# Altium schematic sheet Sheet1.SchDoc
size A4; CompanyName: Shanghai MCUStar Electronic Technology Co., Ltd.; Engineer: Conan; Address1: http://www.mcustar.com; PageSetup: Record=PageOptions|CenterHorizontal=True|CenterVertical=True|PrintScale=0.96|XCorrection=1.00|YCorrection=1.00|PrintKind=0|BorderSize=5000000|LeftOffset=0|BottomOffset=0|Orientation=2|PaperLength=1000|PaperWidth=1000|Scale=100|PaperSource=7|PrintQuality=-4|MediaType=1|DitherType=10|PaperKind=A4|PrintScaleMode=1
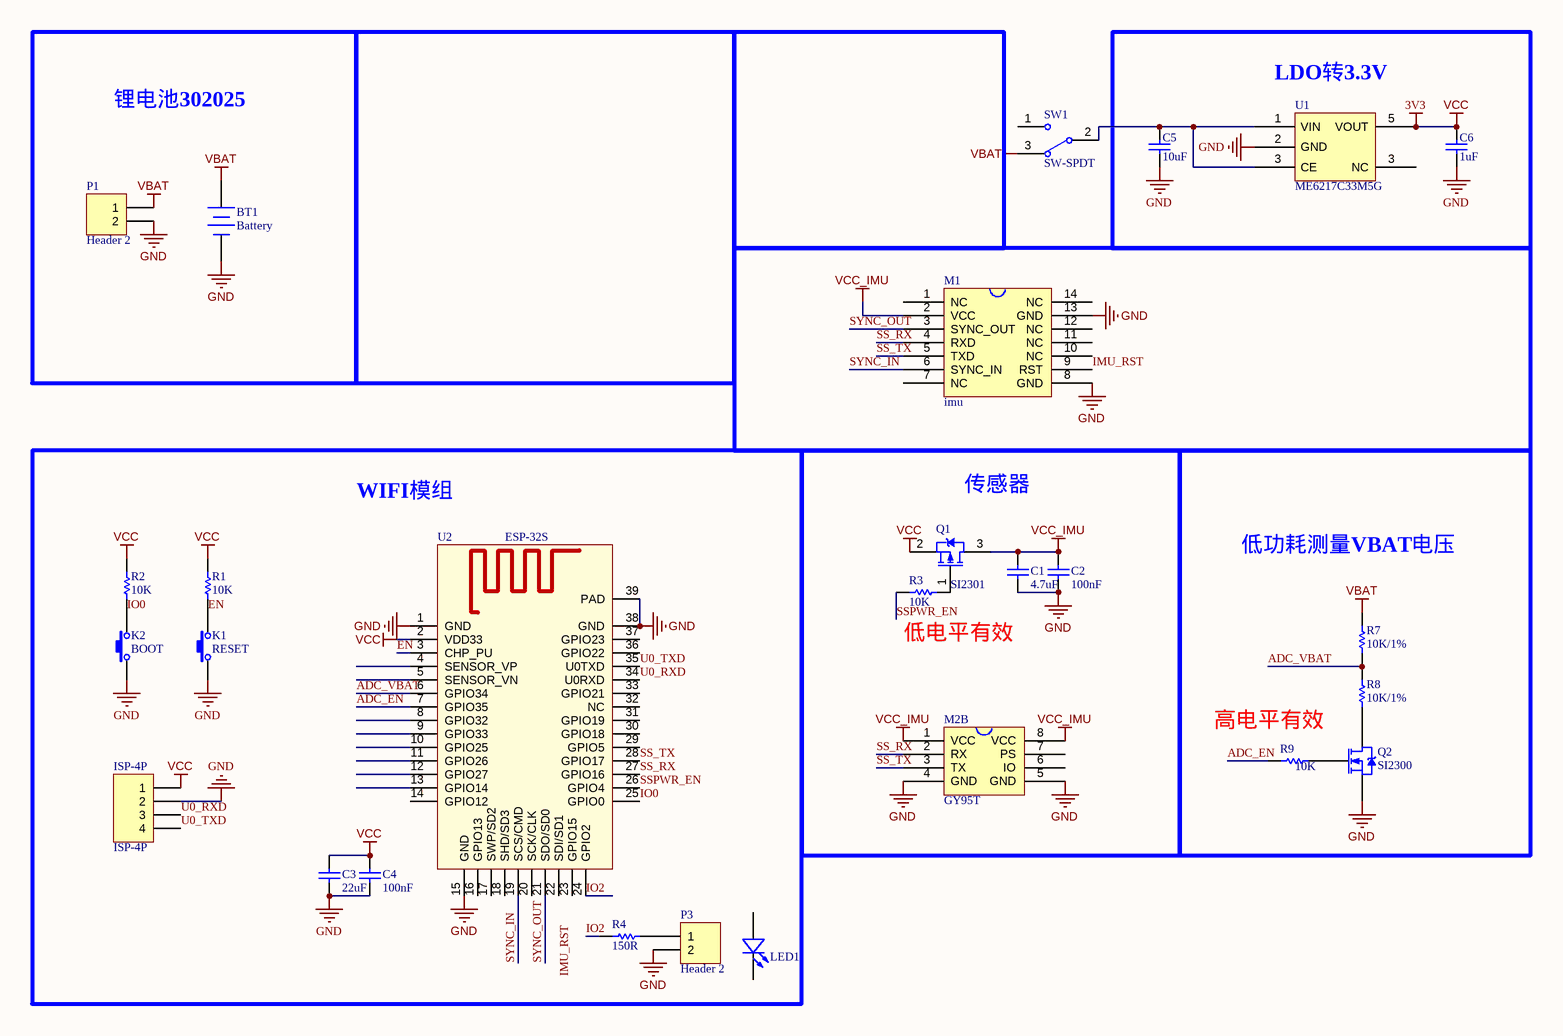
[diagram p0: Sheet1.SchDoc]

## Parts
BT1  Battery  [BATTERY-302025]
C1  4.7uF  [0402C]
C2  100nF  [0402C]
C3  22uF  [0805C]
C4  100nF  [0402C]
C5  10uF  [0402C]
C6  1uF  [0402C]
ISP-4P  ISP-4P  [ISP-4P-2.0/SMD]
K1  RESET  [KEY-SMD/2P/3*4]
K2  BOOT  [KEY-SMD/2P/3*4]
LED1  LED  [0603LED]  (value not drawn)
M1  imu  [HI229]
M2  GY95T  [GY95T]  (part B of 2)
P1  Header 2  [CON-1.25-2P]
P3  Header 2  [HDR1X2]
Q1  SI2301  [SOT-23]
Q2  SI2300  [SOT-23]
R1  10K  [0402]
R2  10K  [0402]
R3  10K  [0402]
R4  150R  [0402]
R7  10K/1%  [0402]
R8  10K/1%  [0402]
R9  10K  [0402]
SW1  SW-SPDT  [SW_MSK12C01]
U1  ME6217C33M5G  [SOT-23-5]
U2  ESP-32S  [ESP-32S]

## Blocks framed on the sheet
锂电池302025: BT1 P1
LDO转3.3V: C5 C6 U1
WIFI模组: C3 C4 ISP-4P K1 K2 LED1 P3 R1 R2 R4 U2

## Nets
3V3: C3.1 C4.1 C6.2 ISP-4P.1 Q1.2(S) R1.1 R2.2 U1.5(VOUT) U2.2(VDD33)  [also labelled VCC]
GND: BT1.2(-) C1.2 C2.2 C3.2 C4.2 C5.1 C6.1 ISP-4P.2 K1.1 K2.1 M1.8(GND) M1.13(GND) M2.4(GND) M2.5(GND) P1.2 P3.2 Q2.2(S) U1.2(GND) U2.1(GND) U2.15(GND) U2.38(GND) U2.39(PAD)
VBAT: BT1.1(+) P1.1 R7.2 SW1.3
VCC_IMU: C1.1 C2.1 M1.2(VCC) M2.1(VCC) M2.8(VCC) Q1.3(D)
ADC_EN: R9.2 U2.7(GPIO35)
ADC_VBAT: R7.1 R8.2 U2.6(GPIO34)
EN: K1.2 R1.2 U2.3(CHP_PU)
IMU_RST: M1.9(RST)
IO0: K2.2 R2.1 U2.25(GPIO0)
IO2: R4.1 U2.24(GPIO2)
SS_RX: M1.4(RXD) M2.2(RX) U2.27(GPIO16)
SS_TX: M1.5(TXD) M2.3(TX) U2.28(GPIO17)
SSPWR_EN: R3.2 U2.26(GPIO4)
SYNC_IN: M1.6(SYNC_IN) U2.19(SCS/CMD)
SYNC_OUT: M1.3(SYNC_OUT) U2.21(SDO/SD0)
U0_RXD: ISP-4P.3 U2.34(U0RXD)
U0_TXD: ISP-4P.4 U2.35(U0TXD)
NetC5_2: C5.2 SW1.2 U1.1(VIN) U1.3(CE)
NetP3_1: P3.1 R4.2
NetQ1_1: Q1.1(G) R3.1
NetQ2_1: Q2.1(G) R9.1
NetQ2_3: Q2.3(D) R8.1

Not connected (* = marked no-connect by the designer): LED1 1(A) 2(K); M1 1(NC) 7(NC) 10(NC) 11(NC) 12(NC) 14(NC); M2 6(IO) 7(PS); SW1 1; U2 4(SENSOR_VP) 5(SENSOR_VN) 8(GPIO32) 9(GPIO33) 10(GPIO25) 11(GPIO26) 12(GPIO27) 13(GPIO14) 14(GPIO12) 16(GPIO13) 17(SWP/SD2) 18(SHD/SD3) 20(SCK/CLK) 22(SDI/SD1) 23(GPIO15) 29(GPIO5) 30(GPIO18) 31(GPIO19) 32(NC) 33(GPIO21) 36(GPIO22) 37(GPIO23)

## Notes on the sheet
- 传感器
- 低功耗测量VBAT电压
- (near R3) 低电平有效
- (near R9) 高电平有效
- Labels drawn without touching a wire or pin: IMU_RST
- DWG. NO.
- REV.
- SHT.
- THIS DOCUMENT AND THE DATA DISCLOSED HEREIN OR HEREWITH IS THE PROPERTY OF ALTIUM LIMITED AND MAY BE FREELY DISTRIBUTED IN WHOLE. NO RIGHTS ARE RESERVED OR EXPRESS OR IMPLIED WARANTEE GIVEN.
- REVISION
- DESCRIPTION
- DATE
- APPROVED
- ENG:
- APPROVALS
- PROJECT
- DSN:
- CHK:
- REFERENCE DOCUMENTS
- PROJECT REVISION:
- TITLE
- DOCUMENT REVISION:
- DESIGN ITEM:
- BOM:
- FAB DWG:
- PCB DWG:
- ASSY DWG:
- SCALE:
- SIZE
- B
- CAGE CODE
- FILE NAME
- DWG NO.
- SHEET
- OF
- REV

## Library data of the parts
C1 C3 = CAP: Capacitor; Value: 100nF; Published: 8-Jun-2000; Revision: July-2002: Re-released for DXP Platform.; Publisher: Altium Limited
C2 C4 = CAP: Capacitor; Published: 8-Jun-2000; Revision: July-2002: Re-released for DXP Platform.; Publisher: Altium Limited; Value: 100nF
C5 C6 = Cap: Capacitor
ISP-4P = ISP-4P: Header, 4-Pin; LatestRevisionDate: 17-Jul-2002; LatestRevisionNote: Re-released for DXP Platform.; Publisher: Altium Limited
K1 K2 = BUTTON_2P
M1 = HI229
P1 P3 = Header 2: Header, 2-Pin; LatestRevisionDate: 17-Jul-2002; LatestRevisionNote: Re-released for DXP Platform.; Publisher: Altium Limited
Q1 = MOSFET-P: P-Channel Power MOSFET
Q2 = MOSFET-N: N-Channel Power MOSFET
R1-R4 R7-R9 = Res1: Resistor
SW1 = SW-SPDT: SPDT Subminiature Toggle Switch, Right Angle Mounting, Vertical Actuation
U1 = ME6212: 2~6V Input, 350mA output，Voltage LDO
U2 = ESP-32S: ESP32-S系列模组